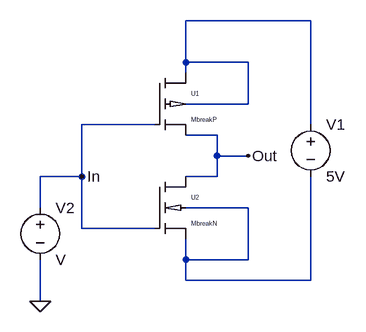
[diagram p0: schematic CMOSinverter.asc]
CMOSinverter.asc, the LTspice schematic file:
Version 4
SHEET 1 880 680
WIRE 384 -32 192 -32
WIRE 192 32 192 -32
WIRE 288 32 192 32
WIRE 192 48 192 32
WIRE 288 96 288 32
WIRE 288 96 192 96
WIRE 144 128 32 128
WIRE 384 128 384 -32
WIRE 240 144 192 144
WIRE 240 176 240 144
WIRE 288 176 240 176
WIRE 32 208 32 128
WIRE 32 208 -32 208
WIRE 240 208 240 176
WIRE 240 208 192 208
WIRE -32 256 -32 208
WIRE 288 256 192 256
WIRE 32 288 32 208
WIRE 144 288 32 288
WIRE 192 336 192 304
WIRE 288 336 288 256
WIRE 288 336 192 336
WIRE 192 368 192 336
WIRE 384 368 384 208
WIRE 384 368 192 368
WIRE -32 400 -32 336
FLAG -32 400 0
FLAG 288 176 Out
FLAG 32 208 In
SYMBOL advee_components\\MbreakN 144 208 R0
SYMATTR InstName U2
SYMBOL advee_components\\MbreakP 144 48 R0
SYMATTR InstName U1
SYMBOL voltage 384 112 R0
SYMATTR InstName V1
SYMATTR Value 5V
SYMBOL voltage -32 240 R0
SYMATTR InstName V2

The netlist it stands for:
* CMOSinverter.asc
XU2 Out In N002 N002 MbreakN  ; pins D G S B
XU1 N001 In Out N001 MbreakP  ; pins D G S B
V1 N001 N002 5V
V2 In 0 V
.lib AdvEE_Components.lib
.backanno
.end